# EAGLE design Shruthi-Analog-SVF-v03 (EAGLE 9.6.2)
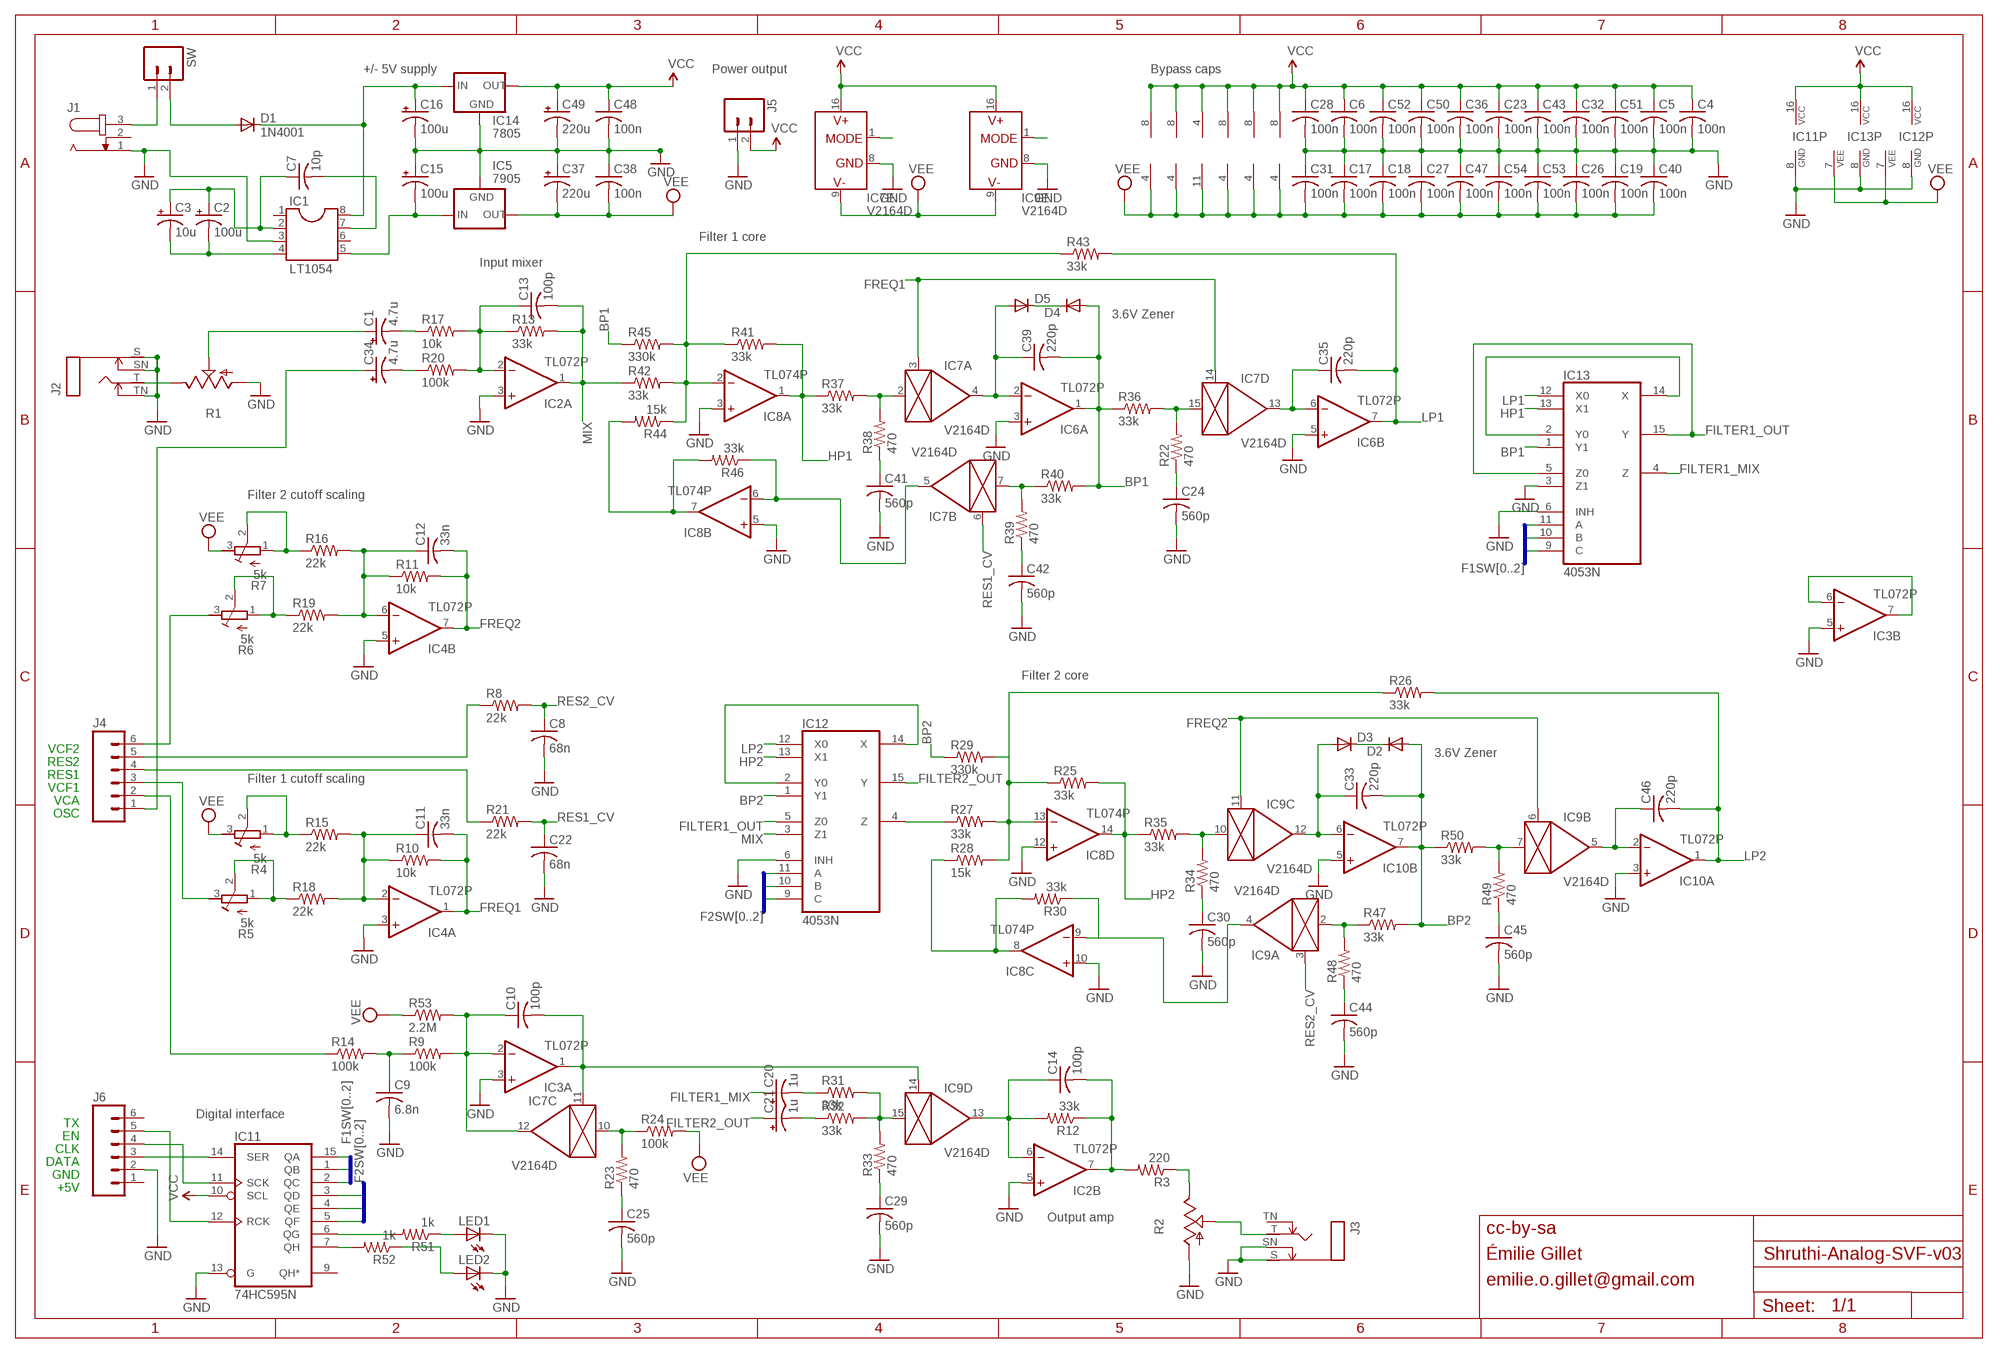
[diagram p0: schematic, sheet 1]

## Parts
C1  4.7u  CPOL-USE2.5-6  [E2,5-6]
C2  100u  CPOL-USE2.5-6  [E2,5-6]
C3  10u  CPOL-USE2.5-5  [E2,5-5]
C4  100n  C-US025-025X050  [C025-025X050]
C5  100n  C-US025-025X050  [C025-025X050]
C6  100n  C-US025-025X050  [C025-025X050]
C7  10p  C-US025-025X050  [C025-025X050]
C8  68n  C-US050-025X075  [C050-025X075]
C9  6.8n  C-US025-025X050  [C025-025X050]
C10  100p  C-US025-025X050  [C025-025X050]
C11  33n  C-US050-025X075  [C050-025X075]
C12  33n  C-US050-025X075  [C050-025X075]
C13  100p  C-US025-025X050  [C025-025X050]
C14  100p  C-US025-025X050  [C025-025X050]
C15  100u  CPOL-USE2.5-7  [E2,5-7]
C16  100u  CPOL-USE2.5-7  [E2,5-7]
C17  100n  C-US025-025X050  [C025-025X050]
C18  100n  C-US025-025X050  [C025-025X050]
C19  100n  C-US025-025X050  [C025-025X050]
C20  1u  CPOL-USE2-5  [E2-5]
C21  1u  CPOL-USE2-5  [E2-5]
C22  68n  C-US050-025X075  [C050-025X075]
C23  100n  C-US025-025X050  [C025-025X050]
C24  560p  C-US025-025X050  [C025-025X050]
C25  560p  C-US025-025X050  [C025-025X050]
C26  100n  C-US025-025X050  [C025-025X050]
C27  100n  C-US025-025X050  [C025-025X050]
C28  100n  C-US025-025X050  [C025-025X050]
C29  560p  C-US025-025X050  [C025-025X050]
C30  560p  C-US025-025X050  [C025-025X050]
C31  100n  C-US025-025X050  [C025-025X050]
C32  100n  C-US025-025X050  [C025-025X050]
C33  220p  C-US025-025X050  [C025-025X050]
C34  4.7u  CPOL-USE2.5-6  [E2,5-6]
C35  220p  C-US025-025X050  [C025-025X050]
C36  100n  C-US025-025X050  [C025-025X050]
C37  220u  CPOL-USE5-10.5  [E5-10,5]
C38  100n  C-US025-025X050  [C025-025X050]
C39  220p  C-US025-025X050  [C025-025X050]
C40  100n  C-US025-025X050  [C025-025X050]
C41  560p  C-US025-025X050  [C025-025X050]
C42  560p  C-US025-025X050  [C025-025X050]
C43  100n  C-US025-025X050  [C025-025X050]
C44  560p  C-US025-025X050  [C025-025X050]
C45  560p  C-US025-025X050  [C025-025X050]
C46  220p  C-US025-025X050  [C025-025X050]
C47  100n  C-US025-025X050  [C025-025X050]
C48  100n  C-US025-025X050  [C025-025X050]
C49  220u  CPOL-USE5-10.5  [E5-10,5]
C50  100n  C-US025-025X050  [C025-025X050]
C51  100n  C-US025-025X050  [C025-025X050]
C52  100n  C-US025-025X050  [C025-025X050]
C53  100n  C-US025-025X050  [C025-025X050]
C54  100n  C-US025-025X050  [C025-025X050]
D1  1N4001  1N4004  [DO41-10]
D2  DIODE-D-5  [D-5]
D3  DIODE-D-5  [D-5]
D4  DIODE-D-5  [D-5]
D5  DIODE-D-5  [D-5]
IC1  LT1054  DIL8  [DIL08]
IC2  TL072P  [DIL08]
IC3  TL072P  [DIL08]
IC4  TL072P  [DIL08]
IC5  7905  79XXS  [79XXS]
IC6  TL072P  [DIL08]
IC7  V2164D  SSM2164P  [DIL16]
IC8  TL074P  [DIL14]
IC9  V2164D  SSM2164P  [DIL16]
IC10  TL072P  [DIL08]
IC11  74HC595N  [DIL16]
IC12  4053N  [DIL16]
IC13  4053N  [DIL16]
IC14  7805  78XXS  [78XXS]
J1  JACK-PLUG2  [SPC4078_BIG_HOLES]
J2  MONOSWS  [NMJ4HC-S]
J3  MONOSWS  [NMJ4HC-S]
J4  M06SIP  [1X06]
J5  M02PTH  [1X02]
J6  M06SIP  [1X06]
LED1  LEDCHIP-LED0603  [CHIP-LED0603]
LED2  LEDCHIP-LED0603  [CHIP-LED0603]
R1  POT_USCABLED  [CABLE_POT_6MM]
R2  POT_USCABLED  [CABLE_POT_6MM]
R3  220  R-US_0204/7  [0204/7]
R4  5k  R-TRIMM3296X  [RTRIM3296X]
R5  5k  R-TRIMM3296X  [RTRIM3296X]
R6  5k  R-TRIMM3296X  [RTRIM3296X]
R7  5k  R-TRIMM3296X  [RTRIM3296X]
R8  22k  R-US_0204/7  [0204/7]
R9  100k  R-US_0204/7  [0204/7]
R10  10k  R-US_0204/7  [0204/7]
R11  10k  R-US_0204/7  [0204/7]
R12  33k  R-US_0204/7  [0204/7]
R13  33k  R-US_0204/7  [0204/7]
R14  100k  R-US_0204/7  [0204/7]
R15  22k  R-US_0204/7  [0204/7]
R16  22k  R-US_0204/7  [0204/7]
R17  10k  R-US_0204/7  [0204/7]
R18  22k  R-US_0204/7  [0204/7]
R19  22k  R-US_0204/7  [0204/7]
R20  100k  R-US_0204/7  [0204/7]
R21  22k  R-US_0204/7  [0204/7]
R22  470  R-US_0204/7  [0204/7]
R23  470  R-US_0204/7  [0204/7]
R24  100k  R-US_0204/7  [0204/7]
R25  33k  R-US_0204/7  [0204/7]
R26  33k  R-US_0204/7  [0204/7]
R27  33k  R-US_0204/7  [0204/7]
R28  15k  R-US_0204/7  [0204/7]
R29  330k  R-US_0204/7  [0204/7]
R30  33k  R-US_0204/7  [0204/7]
R31  33k  R-US_0204/7  [0204/7]
R32  33k  R-US_0204/7  [0204/7]
R33  470  R-US_0204/7  [0204/7]
R34  470  R-US_0204/7  [0204/7]
R35  33k  R-US_0204/7  [0204/7]
R36  33k  R-US_0204/7  [0204/7]
R37  33k  R-US_0204/7  [0204/7]
R38  470  R-US_0204/7  [0204/7]
R39  470  R-US_0204/7  [0204/7]
R40  33k  R-US_0204/7  [0204/7]
R41  33k  R-US_0204/7  [0204/7]
R42  33k  R-US_0204/7  [0204/7]
R43  33k  R-US_0204/7  [0204/7]
R44  15k  R-US_0204/7  [0204/7]
R45  330k  R-US_0204/7  [0204/7]
R46  33k  R-US_0204/7  [0204/7]
R47  33k  R-US_0204/7  [0204/7]
R48  470  R-US_0204/7  [0204/7]
R49  470  R-US_0204/7  [0204/7]
R50  33k  R-US_0204/7  [0204/7]
R51  1k  R-US_0204/7  [0204/7]
R52  1k  R-US_0204/7  [0204/7]
R53  2.2M  R-US_0204/2V  [0204V]
SW  M02PTH  [1X02]

## Nets
BP1: C39.2 D4.A IC6.1(A:OUT) IC13.1(Y1) R36.1 R40.2 R45.1
BP2: C33.2 D2.A IC10.7(B:OUT) IC12.1(Y1) R29.1 R47.2 R50.1
F1SW0: IC11.15(QA) IC13.9(C)
F1SW1: IC11.1(QB) IC13.10(B)
F1SW2: IC11.2(QC) IC13.11(A)
F2SW0: IC11.3(QD) IC12.9(C)
F2SW1: IC11.4(QE) IC12.10(B)
F2SW2: IC11.5(QF) IC12.11(A)
FILTER1_MIX: C20.+ IC13.4(Z)
FILTER1_OUT: IC12.5(Z0) IC13.5(Z0) IC13.15(Y)
FILTER2_OUT: C21.+ IC12.15(Y)
FREQ1: C11.2 IC4.1(A:OUT) IC7.3(A:CTRL) IC7.14(D:CTRL) R10.2
FREQ2: C12.2 IC4.7(B:OUT) IC9.6(B:CTRL) IC9.11(C:CTRL) R11.2
GND: C4.2 C5.2 C6.2 C8.2 C9.2 C15.+ C16.- C17.1 C18.1 C19.1 C22.2 C23.2 C24.2 C25.2 C26.1 C27.1 C28.2 C29.2 C30.2 C31.1 C32.2 C36.2 C37.+ C38.1 C40.1 C41.2 C42.2 C43.2 C44.2 C45.2 C47.1 C48.2 C49.- C50.2 C51.2 C52.2 C53.1 C54.1 IC1.3 IC2.3(A:+IN) IC2.5(B:+IN) IC3.3(A:+IN) IC3.5(B:+IN) IC4.3(A:+IN) IC4.5(B:+IN) IC5.GND IC6.3(A:+IN) IC6.5(B:+IN) IC7.8(E:GND) IC8.3(A:+IN) IC8.5(B:+IN) IC8.10(C:+IN) IC8.12(D:+IN) IC9.8(E:GND) IC10.3(A:+IN) IC10.5(B:+IN) IC11.8(GND) IC11.13(G) IC12.6(INH) IC12.8(GND) IC13.3(Z1) IC13.6(INH) IC13.8(GND) IC14.GND J1.1 J2.S J2.SN J2.TN J3.S J3.SN J5.1 J6.2 LED1.C LED2.C R1.A R2.A
HP1: IC8.1(A:OUT) IC13.13(X1) R37.1 R41.2
HP2: IC8.14(D:OUT) IC12.13(X1) R25.2 R35.1
LP1: C35.2 IC6.7(B:OUT) IC13.12(X0) R43.2
LP2: C46.2 IC10.1(A:OUT) IC12.12(X0) R26.2
MIX: C13.2 IC2.1(A:OUT) IC12.3(Z1) R13.2 R42.1
N$1: C2.+ C3.+ C7.1 IC1.2
N$2: C12.1 IC4.6(B:-IN) R11.1 R16.2 R19.2
N$3: J1.3 SW.1
N$4: C16.+ D1.C IC1.8 IC14.IN
N$5: C2.- C3.- IC1.4
N$6: C13.1 IC2.2(A:-IN) R13.1 R17.2 R20.2
N$7: R6.1(E) R6.2(S) R19.1
N$8: J4.6 R6.3(A)
N$9: R7.1(E) R7.2(S) R16.1
N$10: IC7.10(C:IN) R23.2 R24.1
N$11: C10.1 IC3.2(A:-IN) IC7.12(C:OUT) R9.2 R53.2
N$12: IC8.2(A:-IN) R41.1 R42.2 R43.1 R44.1 R45.2
N$13: IC11.12(RCK) J6.5
N$14: IC11.14(SER) J6.3
N$15: IC11.6(QG) R51.2
N$16: IC11.11(SCK) J6.4
N$17: C24.1 R22.1
N$18: IC8.13(D:-IN) R25.1 R26.1 R27.2 R28.2 R29.2
N$19: C39.1 D5.A IC6.2(A:-IN) IC7.4(A:OUT)
N$20: C33.1 D3.A IC9.12(C:OUT) IC10.6(B:-IN)
N$21: IC7.7(B:IN) R39.2 R40.1
N$22: C9.1 R9.1 R14.2
N$23: IC8.8(C:OUT) R28.1 R30.2
N$24: IC9.2(A:IN) R47.1 R48.2
N$25: R2.E R3.1
N$26: IC7.15(D:IN) R22.2 R36.2
N$27: C42.1 R39.1
N$28: C35.1 IC6.6(B:-IN) IC7.13(D:OUT)
N$29: IC7.2(A:IN) R37.2 R38.2
N$30: C41.1 R38.1
N$31: IC7.5(B:OUT) IC8.6(B:-IN) R46.1
N$32: LED1.A R51.1
N$33: D2.C D3.C
N$34: IC9.7(B:IN) R49.2 R50.2
N$35: C34.+ J4.1
N$36: C7.2 IC1.7
N$37: IC8.9(C:-IN) IC9.4(A:OUT) R30.1
N$38: J2.T R1.E
N$39: C34.- R20.1
N$40: C11.1 IC4.2(A:-IN) R10.1 R15.2 R18.2
N$41: R5.1(E) R5.2(S) R18.1
N$42: J4.3 R5.3(A)
N$43: R4.1(E) R4.2(S) R15.1
N$44: C46.1 IC9.5(B:OUT) IC10.2(A:-IN)
N$45: J4.2 R14.1
N$46: C45.1 R49.1
N$47: J3.T R2.S
N$48: IC8.7(B:OUT) R44.2 R46.2
N$49: C44.1 R48.1
N$50: IC9.10(C:IN) R34.2 R35.2
N$51: C30.1 R34.1
N$52: LED2.A R52.1
N$53: IC11.7(QH) R52.2
N$55: D4.C D5.C
N$56: C10.2 IC3.1(A:OUT) IC7.11(C:CTRL) IC9.14(D:CTRL)
N$57: C20.- R31.1
N$58: C15.- IC1.5 IC5.IN
N$59: D1.A SW.2
N$60: C21.- R32.1
N$61: IC3.6(B:-IN) IC3.7(B:OUT)
N$62: IC13.2(Y0) IC13.14(X)
N$63: C14.2 IC2.7(B:OUT) R3.2 R12.1
N$64: C25.1 R23.1
N$65: C29.1 R33.1
N$66: C1.+ R1.S
N$67: IC9.15(D:IN) R31.2 R32.2 R33.2
N$68: IC7.1(E:MODE)
N$69: J4.4 R21.1
N$70: C14.1 IC2.6(B:-IN) IC9.13(D:OUT) R12.2
N$71: IC9.1(E:MODE)
N$72: C1.- R17.1
N$73: J4.5 R8.1
N$74: IC12.2(Y0) IC12.14(X)
N$75: IC12.4(Z) R27.1
RES1_CV: C22.1 IC7.6(B:CTRL) R21.2
RES2_CV: C8.1 IC9.3(A:CTRL) R8.2
VCC: C4.1 C5.1 C6.1 C23.1 C28.1 C32.1 C36.1 C43.1 C48.1 C49.+ C50.1 C51.1 C52.1 IC2.8(P:V+) IC3.8(P:V+) IC4.8(P:V+) IC6.8(P:V+) IC7.16(E:V+) IC8.4(P:V+) IC9.16(E:V+) IC10.8(P:V+) IC11.10(SCL) IC11.16(VCC) IC12.16(VCC) IC13.16(VCC) IC14.OUT J5.2
VEE: C17.2 C18.2 C19.2 C26.2 C27.2 C31.2 C37.- C38.2 C40.2 C47.2 C53.2 C54.2 IC2.4(P:V-) IC3.4(P:V-) IC4.4(P:V-) IC5.OUT IC6.4(P:V-) IC7.9(E:V-) IC8.11(P:V-) IC9.9(E:V-) IC10.4(P:V-) IC12.7(VEE) IC13.7(VEE) R4.3(A) R7.3(A) R24.2 R53.1
Unconnected: IC1.1 IC1.6 IC11.9(QH*) J1.2 J3.TN J6.1 J6.6

## Buses
F1SW[0..2]
F2SW[0..2]

## Notes on the sheet
- +/- 5V supply | Power output | Bypass caps
- Filter 1 core
- Input mixer
- 3.6V Zener
- Filter 2 cutoff scaling
- Filter 2 core
- VCF2
- RES2 | 3.6V Zener
- RES1
- VCF1 | Filter 1 cutoff scaling
- VCA
- OSC
- TX | Digital interface
- EN
- CLK
- DATA
- GND
- +5V
- Output amp
- cc-by-sa
- Émilie Gillet
- emilie.o.gillet@gmail.com

## Library data of the parts
C1-C3 C15 C16 C20 C21 C34 C37 C49 = rcl:CPOL-US: POLARIZED CAPACITOR, American symbol
C4-C14 C17-C19 C22-C33 C35 C36 C38-C48 C50-C54 = rcl:C-US: CAPACITOR, American symbol
D1 = diode:1N4004: DIODE general purpose rectifier, 1 A
D2-D5 = diode:DIODE-: DIODE
IC1 = ic-package:DIL8: Dual In Line / Socket
IC2-IC4 IC6 IC10 = og-linear:TL072: OP AMP
IC5 = v-reg:79XXS: VOLTAGE REGULATOR
IC7 IC9 = ssm2164:SSM2164
IC8 = linear:TL074: OP AMP
IC11 = 74xx-eu:74*595: 8-bit SHIFT REGISTER, output latch
IC12 IC13 = 40xx:4053: Triple 2-channel ANALOG MULTIPLEXER
IC14 = v-reg:78XXS: VOLTAGE REGULATOR
J1 = con-jack2:JACK-PLUG: DC POWER JACK Power Jack, DC, Right Angle, Through Hole, Rated 5A at 16VDC, PC Terminals Distributor: Farnell (www.Farnell.de) Drawing: 84N1161.pdf / 84N1162.pdf Manufacturer: SPC Technology (www.spctechnology.com) Type: SPC4077 / SPC 4078
J2 J3 = gm-jacks:MONOSW
J4 J6 = SparkFun:M06: Header 6 Standard 6-pin 0.1" header. Use with straight break away headers (SKU : PRT-00116), right angle break away headers (PRT-00553), swiss pins (PRT-00743), machine pins (PRT-00117), and female headers (PRT-00115). Molex polarized connector foot print use with SKU : PRT-08094 with associated crimp pins and housings. NOTES ON THE VARIANTS LOCK and LOCK_LONGPADS... This footprint was designed to help hold the alignment of a through-hole component (i.e. 6-pin header) while soldering it into place. You may notice that each hole has been shifted either up or down by 0.005 of an inch from it's more standard position (which is a perfectly straight line). This slight alteration caused the pins (the squares in the middle) to touch the edges of the holes. Because they are alternating, it causes a "brace" to hold the component in place. 0.005 has proven to be the perfect amount of "off-center" position when using our standard breakaway headers. Although looks a little odd when you look at the bare footprint, once you have a header in there, the alteration is very hard to notice. Also, if you push a header all the way into place, it is covered up entirely on the bottom side. This idea of altering the position of holes to aid alignment will be further integrated into the Sparkfun Library for other footprints. It can help hold any component with 3 or more connection pins.
J5 SW = SparkFun:M02: Header 2 Standard 2-pin 0.1" header. Use with straight break away headers (SKU : PRT-00116), right angle break away headers (PRT-00553), swiss pins (PRT-00743), machine pins (PRT-00117), and female headers (PRT-00115). Molex polarized connector foot print use with SKU : PRT-08233 with associated crimp pins and housings.
LED1 LED2 = led:LED: LED OSRAM: - CHIPLED LG R971, LG N971, LY N971, LG Q971, LY Q971, LO R971, LY R971 LH N974, LH R974 LS Q976, LO Q976, LY Q976 LO Q996 - Hyper CHIPLED LW Q18S LB Q993, LB Q99A, LB R99A - SideLED LS A670, LO A670, LY A670, LG A670, LP A670 LB A673, LV A673, LT A673, LW A673 LH A674 LY A675 LS A676, LA A676, LO A676, LY A676, LW A676 LS A679, LY A679, LG A679 - Hyper Micro SIDELED® LS Y876, LA Y876, LO Y876, LY Y876 LT Y87S - SmartLED LW L88C, LW L88S LB L89C, LB L89S, LG L890 LS L89K, LO L89K, LY L89K LS L896, LA L896, LO L896, LY L896 - TOPLED LS T670, LO T670, LY T670, LG T670, LP T670 LSG T670, LSP T670, LSY T670, LOP T670, LYG T670 LG T671, LOG T671, LSG T671 LB T673, LV T673, LT T673, LW T673 LH T674 LS T676, LA T676, LO T676, LY T676, LB T676, LH T676, LSB T676, LW T676 LB T67C, LV T67C, LT T67C, LS T67K, LO T67K, LY T67K, LW E67C LS E67B, LA E67B, LO E67B, LY E67B, LB E67C, LV E67C, LT E67C LW T67C LS T679, LY T679, LG T679 LS T770, LO T770, LY T770, LG T770, LP T770 LB T773, LV T773, LT T773, LW T773 LH T774 LS E675, LA E675, LY E675, LS T675 LS T776, LA T776, LO T776, LY T776, LB T776 LHGB T686 LT T68C, LB T68C - Hyper Mini TOPLED® LB M676 - Mini TOPLED Santana® LG M470 LS M47K, LO M47K, LY M47K Source: http://www.osram.convergy.de LUXEON: - LUMILED® LXK2-PW12-R00, LXK2-PW12-S00, LXK2-PW14-U00, LXK2-PW14-V00 LXK2-PM12-R00, LXK2-PM12-S00, LXK2-PM14-U00 LXK2-PE12-Q00, LXK2-PE12-R00, LXK2-PE12-S00, LXK2-PE14-T00, LXK2-PE14-U00 LXK2-PB12-K00, LXK2-PB12-L00, LXK2-PB12-M00, LXK2-PB14-N00, LXK2-PB14-P00, LXK2-PB14-Q00 LXK2-PR12-L00, LXK2-PR12-M00, LXK2-PR14-Q00, LXK2-PR14-R00 LXK2-PD12-Q00, LXK2-PD12-R00, LXK2-PD12-S00 LXK2-PH12-R00, LXK2-PH12-S00 LXK2-PL12-P00, LXK2-PL12-Q00, LXK2-PL12-R00 Source: www.luxeon.com KINGBRIGHT: KA-3528ASYC Source: www.kingbright.com
R1 R2 = pot-alps:POT_US
R3 R8-R53 = rcl:R-US_: RESISTOR, American symbol
R4-R7 = rcl:R-TRIMM: Trimm resistor

## Board
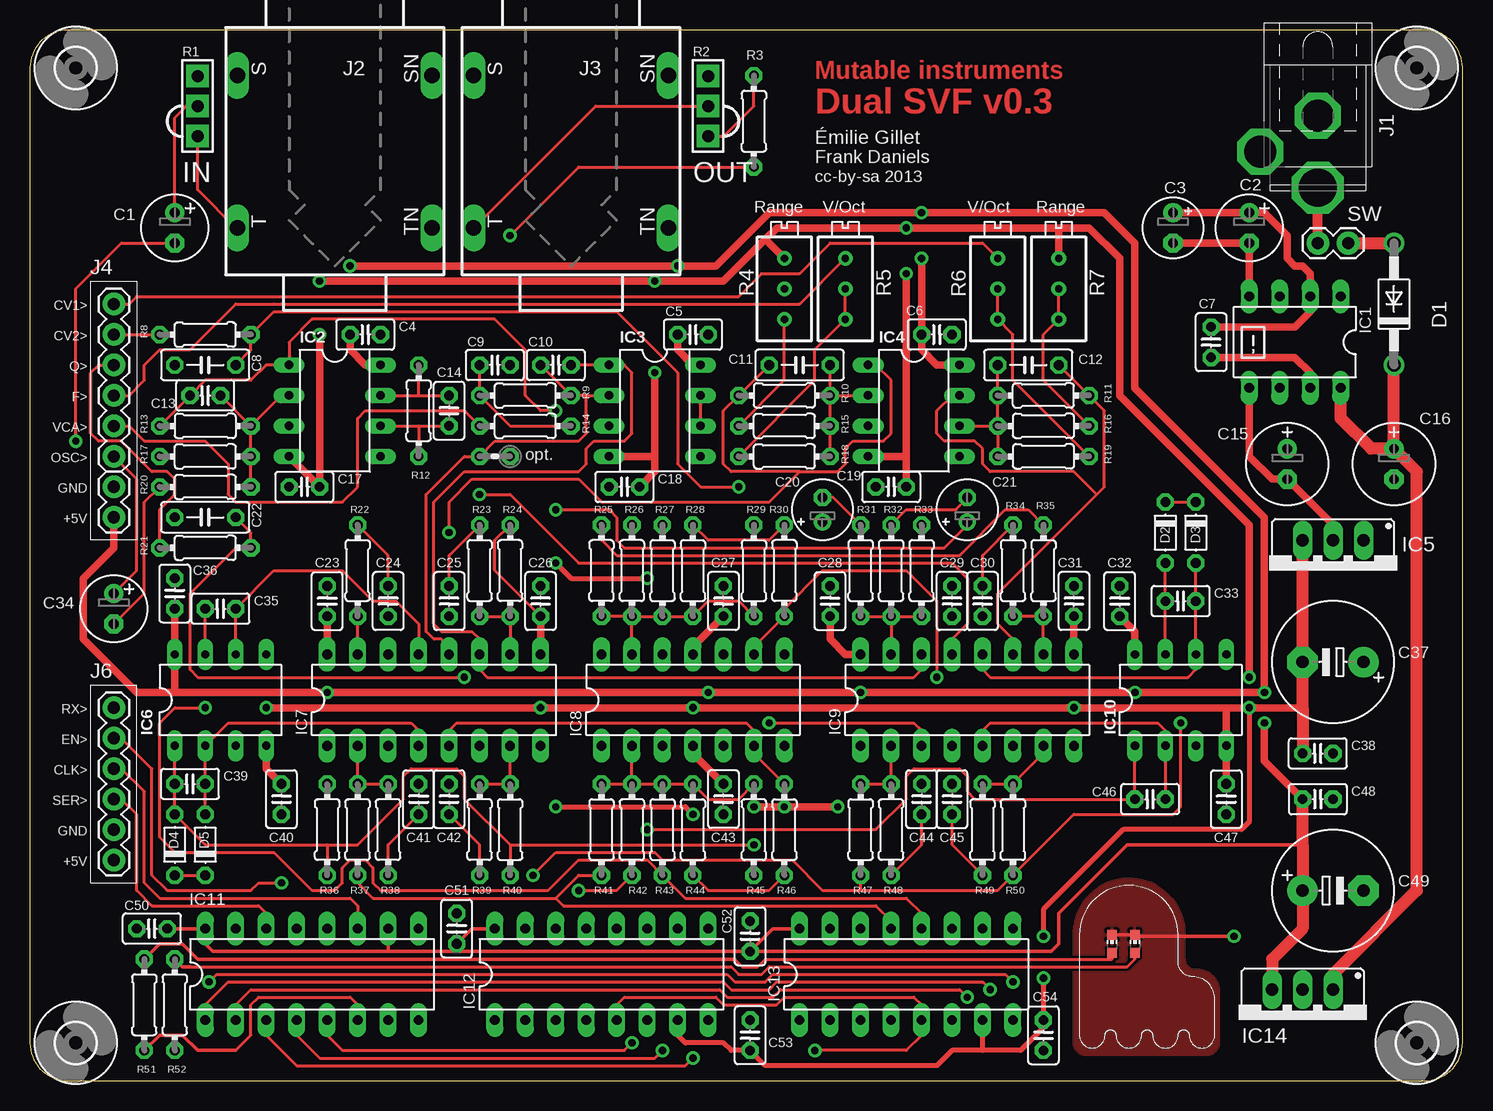
[diagram p1: board, top side]
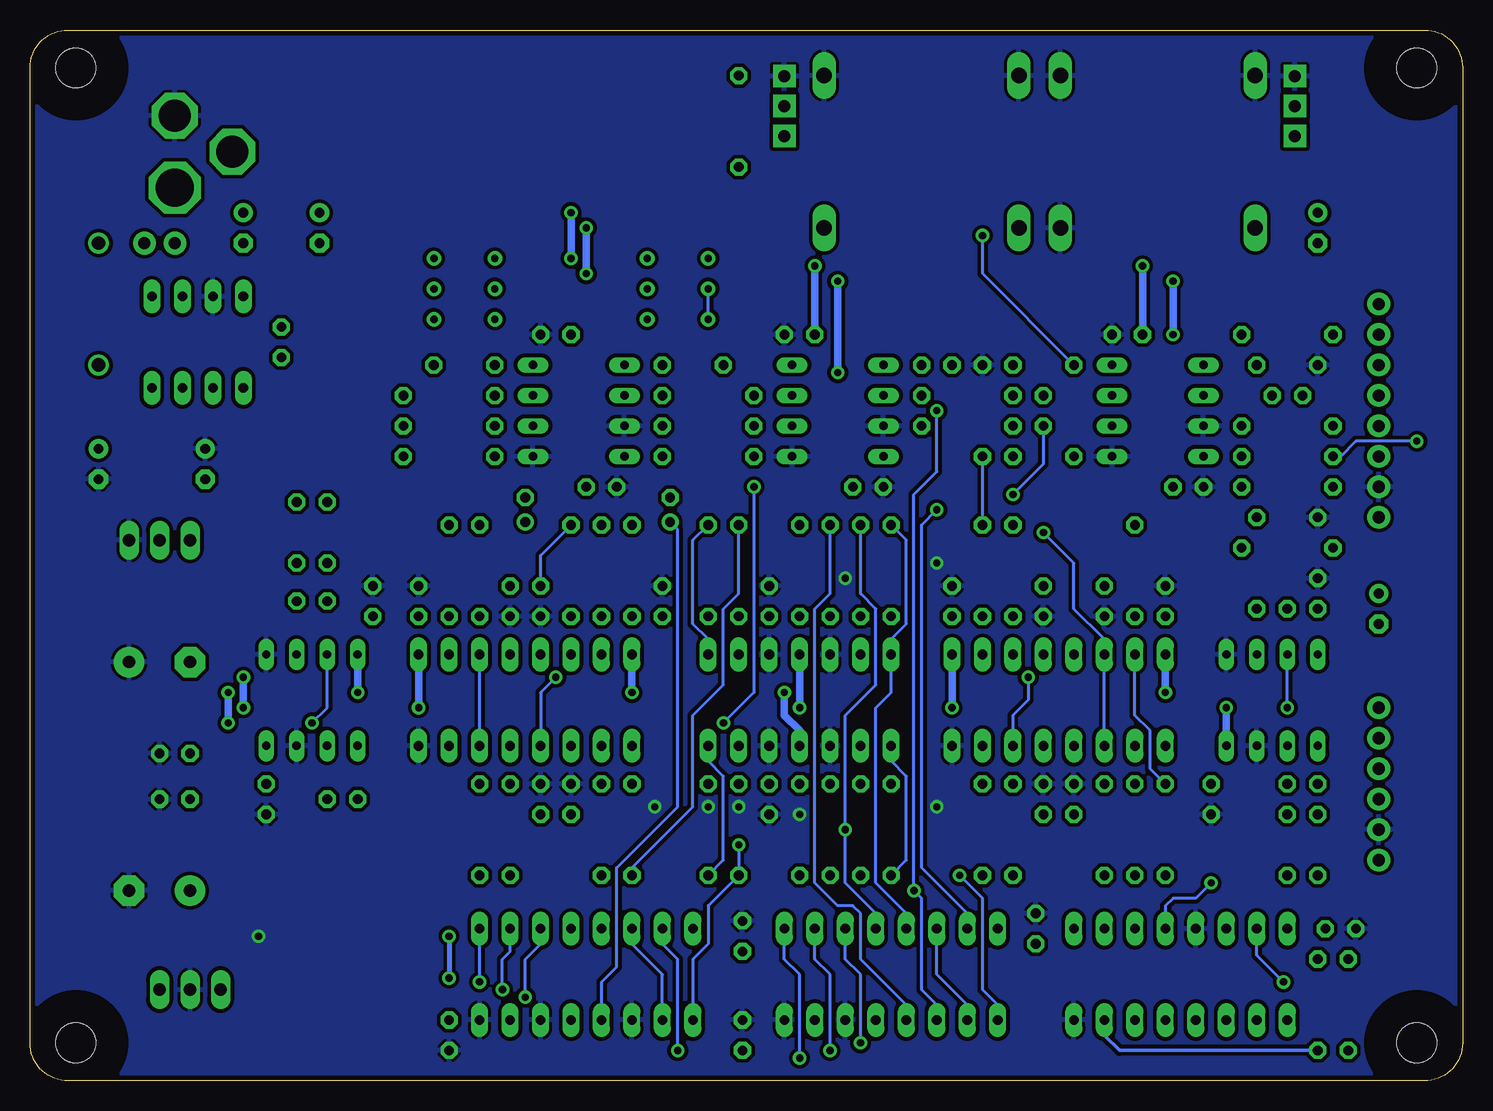
[diagram p2: board, bottom side, seen from below]

Size 119.38 x 87.62 mm. Coordinates in mm from the lower left corner, seen from the top.
Outline: 116.2,0 arc90 119.38,3.17 119.38,84.45 arc90 116.22,87.62 3.17,87.62 arc90 0,84.45 0,3.17 arc90 3.18,0 116.2,0
Copper layers (1*16): Top 0.035mm / dielectric 1.5mm / Bottom 0.035mm
Design rules "SparkFun *": minimum track width 8mil, minimum drill 20mil, track to track 8mil, track to pad 8mil, pad to pad 8mil, via to via 8mil, smd to smd 8mil, copper to edge 10mil, drill to drill 8mil, minimum pad ring 12mil, minimum via ring 10mil, stop-mask expansion 4mil, vias tented up to drill 25mil, thermal gap 10mil

### Footprints (pad centres in the part's own frame; a part is rotated, then mirrored left to right if it is on the bottom)
E2,5-6 = drill 0.813 pad 1.6: + -1.27,0 | drill 0.813 pad 1.6 octagon: - 1.27,0
E2,5-5 = drill 0.813 pad 1.6: + -1.27,0 | drill 0.813 pad 1.6 octagon: - 1.27,0
C025-025X050 = drill 0.813 octagon: 1 -1.27,0; 2 1.27,0
C050-025X075 = drill 0.813 octagon: 1 -2.54,0; 2 2.54,0
E2,5-7 = drill 0.813 pad 1.6: + -1.27,0 | drill 0.813 pad 1.6 octagon: - 1.27,0
E2-5 = drill 0.813 pad 1.27: + -1.016,0 | drill 0.813 pad 1.27 octagon: - 1.016,0
E5-10,5 = drill 1.016 pad 2.54: + -2.54,0 | drill 1.016 pad 2.54 octagon: - 2.54,0
DO41-10 = drill 1.118: A 5.08,0; C -5.08,0
D-5 = drill 0.813 octagon: A 2.54,0; C -2.54,0
DIL08 = drill 0.813 long: 1 -3.81,-3.81; 2 -1.27,-3.81; 3 1.27,-3.81; 4 3.81,-3.81; 5 3.81,3.81; 6 1.27,3.81; 7 -1.27,3.81; 8 -3.81,3.81
DIL08' = drill 0.7 long: 1 -3.81,-3.81; 2 -1.27,-3.81; 3 1.27,-3.81; 4 3.81,-3.81; 5 3.81,3.81; 6 1.27,3.81; 7 -1.27,3.81; 8 -3.81,3.81
79XXS = drill 1.016 long: GND -2.54,-2.54; IN 0,-2.54; OUT 2.54,-2.54
DIL16 = drill 0.813 long: 1 -8.89,-3.81; 2 -6.35,-3.81; 3 -3.81,-3.81; 4 -1.27,-3.81; 5 1.27,-3.81; 6 3.81,-3.81; 7 6.35,-3.81; 8 8.89,-3.81; 9 8.89,3.81; 10 6.35,3.81; 11 3.81,3.81; 12 1.27,3.81; 13 -1.27,3.81; 14 -3.81,3.81; 15 -6.35,3.81; 16 -8.89,3.81
DIL14 = drill 0.813 long: 1 -7.62,-3.81; 2 -5.08,-3.81; 3 -2.54,-3.81; 4 0,-3.81; 5 2.54,-3.81; 6 5.08,-3.81; 7 7.62,-3.81; 8 7.62,3.81; 9 5.08,3.81; 10 2.54,3.81; 11 0,3.81; 12 -2.54,3.81; 13 -5.08,3.81; 14 -7.62,3.81
78XXS = drill 1.016 long: GND 0,-2.54; IN -2.54,-2.54; OUT 2.54,-2.54
SPC4078_BIG_HOLES = drill 2.667 pad 3.81 octagon: 1 -0.46,0; 2 2.54,-4.8 | drill 3.175 pad 4.318 octagon: 3 5.54,0
NMJ4HC-S = drill 1.3 long: S 5.08,8.115; SN 5.08,-8.115; T -7.62,8.115; TN -7.62,-8.115
1X06 = drill 1.016 pad 1.88: 1 0,0; 2 2.54,0; 3 5.08,0; 4 7.62,0; 5 10.16,0; 6 12.7,0
1X02 = drill 1.016 pad 1.88: 1 0,0; 2 2.54,0
CHIP-LED0603 = smd 0.8 x 0.8: A 0,-0.75; C 0,0.75
CABLE_POT_6MM = drill 1 pad 1.88 square: A -2.5,0; E 2.5,0; S 0,0
0204/7 = drill 0.813 octagon: 1 -3.81,0; 2 3.81,0
RTRIM3296X = drill 0.61: 1 0,-2.54; 2 0,0; 3 0,2.54
0204V = drill 0.813 octagon: 1 -1.27,0; 2 1.27,0
3,3 = hole 3.3: 0,0

### Placement (x,y rotation side)
C1  12.07,71.12 270 top
C2  101.6,71.12 270 top
C3  95.25,71.12 270 top
C4  27.94,62.23 0 top
C5  55.24,62.23 0 top
C6  75.56,62.23 0 top
C7  98.42,61.59 270 top
C8  14.61,59.69 180 top
C9  38.73,59.69 0 top
C10  43.81,59.69 0 top
C11  64.14,59.69 180 top
C12  83.19,59.69 0 top
C13  14.61,57.15 180 top
C14  34.93,55.88 90 top
C15  104.78,51.44 270 top
C16  113.67,51.44 270 top
C17  22.86,49.53 0 top
C18  49.53,49.53 0 top
C19  71.75,49.53 0 top
C20  66.04,47.62 90 top
C21  78.11,47.62 90 top
C22  14.61,46.99 180 top
C23  24.77,40.01 90 top
C24  29.84,40.01 270 top
C25  34.93,40.01 270 top
C26  42.55,40.01 270 top
C27  57.78,40.01 270 top
C28  66.67,40.01 90 top
C29  76.83,40.01 270 top
C30  79.38,40.01 270 top
C31  87,40.01 270 top
C32  90.8,40.01 90 top
C33  95.89,40.01 180 top
C34  6.99,39.37 270 top
C35  15.88,39.37 180 top
C36  12.07,40.64 90 top
C37  108.58,34.92 180 top
C38  107.31,27.3 180 top
C39  13.34,24.76 180 top
C40  20.96,23.49 90 top
C41  32.38,23.49 90 top
C42  34.93,23.49 90 top
C43  57.78,23.49 270 top
C44  74.3,23.49 90 top
C45  76.83,23.49 90 top
C46  93.34,23.49 180 top
C47  99.69,23.49 90 top
C48  107.31,23.49 0 top
C49  108.58,15.88 0 top
C50  10.16,12.7 180 top
C51  35.56,12.7 90 top
C52  60.01,12.07 90 top
C53  60.01,3.81 270 top
C54  84.45,3.81 90 top
D1  113.67,64.77 90 top
D2  94.61,45.72 270 top
D3  97.16,45.72 270 top
D4  12.07,19.68 90 top
D5  14.61,19.68 90 top
IC1  105.41,61.59 180 top
IC2  TL072P  [DIL08']  25.4,55.88 270 top
IC3  TL072P  [DIL08']  52.07,55.88 270 top
IC4  TL072P  [DIL08']  73.66,55.88 270 top
IC5  108.58,42.55 180 top
IC6  TL072P  [DIL08']  15.88,31.75 0 top
IC7  33.66,31.75 0 top
IC8  55.24,31.75 0 top
IC9  78.11,31.75 0 top
IC10  TL072P  [DIL08']  95.89,31.75 0 top
IC11  23.5,8.89 0 top
IC12  47.62,8.89 0 top
IC13  73.03,8.89 0 top
IC14  106.05,5.08 180 top
J1  107.31,80.01 270 top
J2  25.4,78.74 90 top
J3  45.09,78.74 90 top
J4  6.99,52.07 90 top
J5  6.99,49.53 270 top
J6  6.99,18.41 90 top
LED1  90.17,11.43 0 top
LED2  92.08,11.43 0 top
R1  13.97,81.28 270 top
R2  56.52,81.28 270 top
R3  60.33,80.01 270 top
R4  62.87,66.04 0 top
R5  67.95,66.04 0 top
R6  80.64,66.04 0 top
R7  85.72,66.04 0 top
R8  14.61,62.23 0 top
R9  41.27,57.15 0 top
R10  62.87,57.15 180 top
R11  84.45,57.15 0 top
R12  32.38,55.88 270 top
R13  14.61,54.61 180 top
R14  41.27,54.61 0 top
R15  62.87,54.61 0 top
R16  84.45,54.61 180 top
R17  14.61,52.07 0 top
R18  62.87,52.07 0 top
R19  84.45,52.07 180 top
R20  14.61,49.53 0 top
R21  14.61,44.45 0 top
R22  27.3,42.55 270 top
R23  37.47,42.55 270 top
R24  40.01,42.55 90 top
R25  47.62,42.55 90 top
R26  50.16,42.55 90 top
R27  52.7,42.55 270 top
R28  55.24,42.55 270 top
R29  60.33,42.55 270 top
R30  62.87,42.55 90 top
R31  69.22,42.55 270 top
R32  71.75,42.55 270 top
R33  74.3,42.55 270 top
R34  81.92,42.55 270 top
R35  84.45,42.55 270 top
R36  24.77,20.95 90 top
R37  27.3,20.95 90 top
R38  29.84,20.95 90 top
R39  37.47,20.95 90 top
R40  40.01,20.95 270 top
R41  47.62,20.95 270 top
R42  50.16,20.95 90 top
R43  52.7,20.95 270 top
R44  55.24,20.95 270 top
R45  60.33,20.95 90 top
R46  62.87,20.95 270 top
R47  69.22,20.95 270 top
R48  71.75,20.95 90 top
R49  79.38,20.95 90 top
R50  81.92,20.95 90 top
R51  9.53,6.35 270 top
R52  12.07,6.35 270 top
R53  38.73,52.07 180 top
SW  107.31,69.85 0 top
U$1  [3,3]  3.81,84.45 0 top
U$2  [3,3]  115.57,84.45 0 top
U$3  [3,3]  3.81,3.17 0 top
U$4  [3,3]  115.57,3.17 0 top

### Tracks (layer width: path | path; a pad name or v marks a point on that pad's centre or on a via)
BP1  (via drill 0.6)
  Top 0.254: IC6.1 C39.2 D4.A 14.61,19.68 24.77,19.68 | 24.77,19.68 27.3,19.68 31.11,23.49 31.11,25.4 31.75,26.04 35.56,26.04 36.2,25.4 36.2,23.49 40.01,19.68 | 40.01,19.68 v60.33,19.68 | 40.01,19.68 R40.2 | 24.77,19.68 R36.1
  Bottom 0.254: IC13.1 64.14,10.16 62.87,11.43 62.87,14.61 R45.1 v60.33,19.68
BP2  (via drill 0.6)
  Top 0.254: IC10.7 C33.2 D2.A | 69.22,15.88 80.64,15.88 R50.1 87,22.22 95.25,22.22 95.89,22.86 v95.89,29.84 | 69.22,15.88 R47.2 | 69.22,15.88 66.04,15.88 63.5,18.41 52.7,18.41 52.07,19.05 43.81,19.05 v41.91,17.14
  Bottom 0.254: IC12.1 38.73,6.35 40.01,7.62 40.01,15.24 v41.91,17.14 | R29.1 60.33,40.64 61.59,39.37 61.59,33.02 64.14,30.48 64.14,22.86 69.22,17.78 R47.2 | v95.89,29.84 94.61,31.11 IC10.7
F1SW0  (via drill 0.6)
  Top 0.254: v14.92,8.26 15.56,8.89 58.1,8.89 58.74,8.26 61.28,8.26 61.91,8.89 80.64,8.89 81.28,8.89 v81.92,8.26
  Bottom 0.254: v81.92,8.26 IC13.9 | IC11.15 17.14,10.48 v14.92,8.26
F1SW1  (via drill 0.6)
  Top 0.254: IC11.1 14.61,6.35 16.51,8.26 57.78,8.26 58.42,7.62 61.59,7.62 62.23,8.26 79.38,8.26 v80.01,7.62
  Bottom 0.254: IC13.10 79.38,10.79 80.01,10.16 v80.01,7.62
F1SW2  (via drill 0.6)
  Top 0.254: IC11.2 17.14,6.35 18.41,7.62 57.47,7.62 58.1,6.98 61.91,6.98 62.55,7.62 77.47,7.62 v78.11,6.98
  Bottom 0.254: v78.11,6.98 78.11,10.16 76.83,11.43 IC13.11
F2SW0  (via drill 0.6)
  Top 0.254: IC11.3 19.68,3.81 22.23,1.27 54.61,1.27 v55.24,1.91
  Bottom 0.254: v55.24,1.91 55.24,8.89 56.52,10.16 IC12.9
F2SW1  (via drill 0.6)
  Top 0.254: IC11.4 22.23,3.81 24.13,1.91 52.07,1.91 v52.7,2.54
  Bottom 0.254: v52.7,2.54 52.7,8.89 53.98,10.16 IC12.10
F2SW2  (via drill 0.6)
  Top 0.254: IC11.5 24.77,3.81 26.04,2.54 49.53,2.54 v50.16,3.17
  Bottom 0.254: v50.16,3.17 50.16,8.89 51.44,10.16 IC12.11
FILTER1_MIX
  Bottom 0.254: IC13.4 71.75,8.26 70.48,9.53 70.48,17.78 65.41,22.86 65.41,45.97 C20.+
FILTER1_OUT  (via drill 0.6)
  Top 0.254: v65.41,2.54 73.03,2.54 74.3,3.81 IC13.5 74.3,6.35 73.66,6.98 62.87,6.98 62.23,6.35 57.78,6.35 57.15,6.98 49.53,6.98 48.89,6.35 IC12.5
  Bottom 0.254: IC13.15 66.67,11.43 65.41,10.16 v65.41,2.54
FILTER2_OUT  (via drill 0.6)
  Top 0.254: v43.81,47.62 48.26,47.62 48.89,46.99 48.89,45.09 49.53,44.45 76.2,44.45 78.11,46.36 C21.+
  Bottom 0.254: IC12.15 41.27,13.97 45.09,17.78 45.09,46.36 v43.81,47.62
FREQ1  (via drill 0.6)
  Top 0.254: v34.93,45.72 34.93,48.26 36.83,50.16 45.72,50.16 47.62,48.26 61.59,48.26 64.14,50.8 | IC4.1 70.48,59.69 71.75,58.42 71.75,53.98 71.12,53.34 68.58,53.34 67.95,52.71 67.95,51.44 67.31,50.8 64.14,50.8 | C11.2 R10.2 57.78,55.88 57.78,51.44 58.42,50.8 64.14,50.8
  Bottom 0.254: IC7.3 IC7.14 29.84,36.83 32.38,39.37 32.38,43.18 v34.93,45.72
FREQ2
  Top 0.254: C12.2 R11.2 89.53,55.88 89.53,49.53 88.9,48.9 | IC9.11 81.92,36.83 80.64,38.1 80.64,40.64 88.9,48.9 | IC4.7 76.83,57.15 75.56,55.88 75.56,53.98 76.2,53.34 78.74,53.34 79.38,52.71 79.38,51.44 80.01,50.8 87,50.8 88.9,48.9
  Bottom 0.254: IC9.6 IC9.11
GND  (via drill 0.6)
  Top 0.305: v100.33,12.07 92.19,12.07 LED2.C LED1.C
  Top 0.406: v43.81,22.86 54.61,22.86 v55.24,22.22 | v43.81,43.18 45.09,41.91 v51.44,41.91
  Top 0.61: v60.33,22.86 v62.87,22.86 v67.31,22.86
  pour Bottom (isolate 0.305): 0.64,87 0.64,0.64 118.75,0.64 118.75,87
  pour Top: 87,12.07 87,3.17 arc90 87.95,2.22 98.11,2.22 arc90 99.06,3.17 99.06,7.62 arc90 97.16,9.21 arc-90 96.2,10.16 96.2,12.38 arc90 91.44,16.83 arc90
HP1
  Top 0.254: 43.81,15.24 44.45,14.61 70.48,14.61 71.75,13.34 IC13.13 | 43.81,15.24 45.72,17.14 R41.2 | 43.81,15.24 28.57,15.24 27.3,16.51 R37.1
  Bottom 0.254: IC8.1 47.62,26.67 46.35,25.4 46.35,18.41 R41.2
HP2
  Top 0.254: R35.1 83.19,47.62 81.28,47.62 77.47,43.82 48.89,43.82 47.62,45.09 R25.2
  Bottom 0.254: IC12.13 46.35,13.97 48.89,16.51 48.89,31.11 47.62,32.38 IC8.14 47.62,36.83 46.35,38.1 46.35,45.09 R25.2
LP1  (via drill 0.6)
  Top 0.254: IC13.12 74.3,13.97 73.03,15.24 54.61,15.24 R43.2 51.44,18.41 45.72,18.41 43.18,15.88 29.21,15.88 28.57,16.51 28.57,17.78 27.94,18.41 26.67,18.41 26.04,17.78 26.04,16.51 25.4,15.88 23.5,15.88 20.32,19.05 12.07,19.05 10.79,20.32 10.79,29.84 12.07,31.11 v14.61,31.11 | IC6.7 C35.2
  Bottom 0.254: v14.61,31.11 IC6.7
LP2  (via drill 0.6)
  Top 0.254: IC10.1 C46.2 78.74,23.49 78.11,24.13 78.11,25.4 77.47,26.04 73.66,26.04 73.03,25.4 73.03,23.49 70.48,20.95 v51.44,20.95
  Bottom 0.254: IC12.12 48.89,13.97 51.44,16.51 v51.44,20.95 51.44,30.48 48.89,33.02 48.89,39.37 50.16,40.64 R26.2
MIX  (via drill 0.6)
  Top 0.254: R13.2 C13.2 14.61,58.42 18.41,58.42 19.68,59.69 IC2.1 21.59,61.59 23.5,63.5 38.73,63.5 41.27,60.96 41.27,57.15 42.55,55.88 v43.81,55.88 | R42.1 48.89,15.88 v45.72,15.88
  Bottom 0.254: IC12.3 43.81,6.35 45.09,7.62 45.09,15.24 v45.72,15.88 45.72,48.9 43.81,50.8 v43.81,55.88
N$1
  Top 0.61: C7.1 105.41,62.87 106.68,64.14 IC1.2 106.68,67.31 106.05,67.95 105.41,67.95 104.78,68.58 104.78,70.48 102.87,72.39 C2.+ C3.+
N$2
  Top 0.254: C12.1 R11.1 R16.2 | R16.2 R19.2 | IC4.6 R16.2
N$3
  Top 0.813: SW.1 J1.3
N$4
  Top 1.016: IC14.IN 108.58,8.89 115.57,15.88 115.57,50.8 C16.+ | C16.+ D1.C | IC1.8 109.22,55.25 111.76,52.71 C16.+
N$5
  Top 0.61: C3.- C2.- IC1.4
N$6
  Top 0.254: R13.1 C13.1 | R13.1 20.96,57.15 IC2.2 | R13.1 R17.2 R20.2
N$7
  Top 0.254: R19.1 81.92,58.42 81.92,62.23 R6.1 R6.2
N$8
  Top 0.254: J4.6 8.26,64.77 8.89,65.41 59.05,65.41 60.96,67.31 64.14,67.31 66.67,69.85 79.38,69.85 R6.3
N$9
  Top 0.254: R16.1 84.45,58.42 84.45,62.23 R7.1 R7.2
N$10
  Top 0.254: IC7.10 R24.1 R23.2
N$11
  Top 0.254: C10.1 R9.2 46.35,57.15 | 46.35,57.15 IC3.2 | IC7.12 34.93,36.2 34.29,36.83 33.66,36.83 33.02,37.47 33.02,48.9 36.2,52.07 R53.2 38.73,53.34 45.72,53.34 46.35,53.98 46.35,57.15
N$12
  Top 0.254: R42.2 R43.1 R44.1 56.52,23.49 59.05,23.49 R45.2 | R41.1 R42.2 | R42.2 IC8.2
N$13  (via drill 0.6)
  Top 0.254: J6.5 7.62,28.57 10.16,26.04 10.16,17.14 11.43,15.88 18.41,15.88 19.05,16.51 v20.96,16.51
  Bottom 0.254: v20.96,16.51 22.23,15.24 24.13,15.24 24.77,14.61 IC11.12
N$14
  Top 0.254: J6.3 7.62,23.49 8.89,22.22 8.89,15.88 10.16,14.61 19.05,14.61 19.68,13.97 IC11.14
N$15
  Top 0.254: 17.14,2.54 18.41,3.81 18.41,6.35 19.05,6.98 26.67,6.98 27.3,6.35 IC11.6
  Top 0.305: 17.14,2.54 13.97,2.54 12.7,3.81 10.79,3.81 R51.2
N$16
  Top 0.254: J6.4 7.62,26.04 9.53,24.13 9.53,16.51 10.79,15.24 26.67,15.24 27.3,14.61 IC11.11
N$17
  Top 0.254: C24.1 29.84,43.82 R22.1
N$18
  Top 0.254: R26.1 R25.1 | R26.1 R27.2 R28.2 56.52,40.01 59.05,40.01 R29.2 | IC8.13 R26.1
N$19
  Top 0.254: IC7.4 32.38,29.21 31.75,29.84 16.51,29.84 IC6.2 C39.1 D5.A
N$20
  Top 0.254: IC9.12 79.38,34.29 80.01,33.66 96.52,33.66 97.16,34.29 IC10.6 C33.1 D3.A
N$21
  Top 0.254: R39.2 R40.1 IC7.7
N$22
  Top 0.254: R14.2 40.01,54.61 R9.1 C9.1
N$23
  Top 0.254: R28.1 56.52,45.09 61.59,45.09 R30.2
  Bottom 0.254: IC8.8 62.87,36.83 64.14,38.1 64.14,45.09 R30.2
N$24
  Top 0.254: R47.1 R48.2 IC9.2
N$25
  Top 0.254: R3.1 60.33,81.28 57.83,78.78 R2.E
N$26
  Top 0.254: IC7.15 R22.2
  Bottom 0.254: IC7.15 27.3,30.48 26.04,29.21 26.04,26.04 R36.2
N$27
  Top 0.254: C42.1 37.47,19.68 R39.1
N$28
  Top 0.254: IC7.13 32.38,38.1 30.48,40.01 28.57,40.01 26.04,42.55 20.32,42.55 C35.1 IC6.6
N$29
  Top 0.254: R38.2 R37.2 IC7.2
N$30
  Top 0.254: C41.1 29.84,19.68 R38.1
N$31
  Top 0.254: R46.1 60.33,27.3 IC8.6 60.33,29.21 59.69,29.84 35.56,29.84 34.93,29.21 IC7.5
N$32
  Top 0.254: 58.74,10.16 59.37,9.53 60.64,9.53 61.28,10.16 90.17,10.16 LED1.A
  Top 0.305: 58.74,10.16 13.97,10.16 12.7,11.43 10.79,11.43 R51.1
N$33
  Top 0.254: D2.C D3.C
N$34
  Top 0.254: R49.2 R50.2 84.45,27.3 IC9.7
N$35
  Top 0.254: J4.1 8.89,50.16 8.89,42.55 C34.+
N$36
  Top 0.61: C7.2 105.41,60.33 106.68,59.05 IC1.7
N$37  (via drill 0.6)
  Top 0.254: IC8.9 60.33,36.2 R30.1 62.87,39.37 66.04,42.55 73.03,42.55 75.56,40.01 v75.56,33.66
  Bottom 0.254: 76.83,29.21 IC9.4 76.83,32.38 v75.56,33.66
N$38
  Top 0.254: J2.T 17.14,71.12 13.97,74.3 R1.E
N$39
  Top 0.254: C34.- 9.53,40.64 9.53,48.26 R20.1
N$40
  Top 0.254: R10.1 C11.1 | R10.1 R15.2 R18.2 | R10.1 IC4.2
N$41
  Top 0.254: R5.2 R5.1 65.41,60.96 65.41,58.42 R18.1
N$42
  Top 0.254: J4.3 8.26,57.15 9.53,58.42 9.53,59.69 10.79,60.96 13.34,60.96 17.14,64.77 20.32,64.77 20.96,64.77 64.14,64.77 R5.3
N$43
  Top 0.254: R15.1 62.87,58.42 R4.1
  Bottom 0.254: R4.1 R4.2
N$44
  Top 0.254: C46.1 IC10.2 94.61,29.21 93.98,29.84 80.01,29.84 79.38,29.21 IC9.5
N$45
  Top 0.254: J4.2 8.26,54.61 9.53,53.34 14.61,53.34 16.51,51.44 16.51,48.9 17.14,48.26 26.04,48.26 27.3,49.53 27.3,55.25 27.94,55.88 36.2,55.88 R14.1
N$46
  Top 0.254: R49.1 76.83,19.68 C45.1
N$47
  Top 0.254: J3.T 47.13,81.28 R2.S
N$48
  Top 0.254: R44.2 56.52,15.88 61.59,15.88 R46.2
  Bottom 0.254: IC8.7 62.87,26.67 61.59,25.4 61.59,18.41 R46.2
N$49
  Top 0.254: R48.1 74.3,19.68 C44.1
N$50
  Top 0.254: R34.2 R35.2 IC9.10
N$51
  Top 0.254: R34.1 79.38,43.82 C30.1
N$52
  Top 0.254: 13.34,9.53 58.42,9.53 59.05,8.89 60.96,8.89 61.59,9.53 91.44,9.53 92.08,10.16 LED2.A
  Top 0.305: 13.34,9.53 12.7,9.53 R52.1
N$53
  Bottom 0.305: IC11.7 29.84,4.45 29.84,3.81 28.57,2.54 R52.2
N$55
  Top 0.254: D4.C D5.C
N$56
  Top 0.254: C10.2 IC3.1 49.53,59.69 50.16,59.05 50.16,53.98 49.53,53.34 46.99,53.34 46.35,52.71 46.35,51.44 45.72,50.8 36.2,50.8 33.66,48.26 33.66,38.1 34.29,37.47 36.83,37.47 37.47,36.83 IC7.11 37.47,34.29 38.1,33.66 73.66,33.66 74.3,34.29 IC9.14
N$57
  Top 0.254: R31.1 66.93,48.64 C20.-
N$58
  Top 0.61: IC5.IN 108.58,46.36 C15.- 103.5,50.16 101.6,52.07 IC1.5
N$59
  Top 1.016: SW.2 D1.A
N$60
  Top 0.254: R32.1 73.03,47.62 77.15,47.62 78.11,48.58 C21.-
N$61
  Top 0.254: IC3.6 IC3.7
N$62
  Bottom 0.254: IC13.2 66.67,8.89 69.22,11.43 IC13.14
N$63  (via drill 0.6)
  Top 0.254: IC2.7 32.38,57.15 | 32.38,57.15 C14.2 | 32.38,57.15 R12.1 | R3.2 45.72,76.2 v40.01,70.48
  Bottom 0.254: R12.1 40.01,67.31 v40.01,70.48
N$64
  Top 0.254: C25.1 34.93,43.82 R23.1
N$65
  Bottom 0.254: R33.1 76.83,43.82 C29.1
N$66
  Top 0.254: C1.+ 12.07,80.33 13.02,81.28 R1.S
N$67
  Top 0.254: R31.2 R32.2 | R32.2 R33.2 | R32.2 IC9.15
N$69
  Top 0.254: J4.4 5.71,59.69 5.08,59.05 5.08,53.98 5.71,53.34 7.62,53.34 10.16,50.8 11.43,50.8 12.07,50.16 12.07,48.9 10.79,47.62 R21.1
N$70  (via drill 0.6)
  Top 0.254: IC9.13 76.83,36.83 78.11,38.1 78.11,41.91 76.83,43.18 45.72,43.18 40.01,48.9 v37.47,48.9 | IC2.6 32.38,54.61 | 32.38,54.61 C14.1 | 32.38,54.61 R12.2
  Bottom 0.254: v37.47,48.9 34.93,51.44 C14.1
N$72  (via drill 0.6)
  Top 0.254: C1.- 7.62,69.85 3.81,66.04 v3.81,53.34
  Bottom 0.254: v3.81,53.34 8.89,53.34 10.16,52.07 R17.1
N$73
  Top 0.254: J4.5 R8.1
N$74
  Bottom 0.254: IC12.2 41.27,6.35 43.81,8.89 IC12.14
N$75
  Bottom 0.254: IC12.4 46.35,6.35 50.16,10.16 50.16,13.97 50.8,14.61 52.07,14.61 53.98,16.51 53.98,39.37 52.7,40.64 R27.1
RES1_CV  (via drill 0.6)
  Top 0.254: C22.1 18.41,45.72 R21.2 17.14,44.45 13.34,40.64 13.34,34.29 13.97,33.66 v36.2,33.66
  Bottom 0.254: v36.2,33.66 36.2,31.75 37.47,30.48 IC7.6
RES2_CV  (via drill 0.6)
  Top 0.254: IC9.3 74.3,29.21 73.66,29.84 v61.59,29.84 | v59.05,49.53 55.88,49.53 53.98,51.44 53.98,59.05 48.89,64.14 20.32,64.14 R8.2 18.41,60.96 C8.1
  Bottom 0.254: v59.05,49.53 59.05,32.38 v61.59,29.84
VCC  (via drill 0.6)
  Top 0.305: C50.1 IC11.16 14.61,11.43 15.24,10.79 29.84,10.79 | 29.84,10.79 35.56,10.79 | 35.56,10.79 C51.1 36.83,12.7 IC12.16 | 35.56,10.79 C52.1 | 29.84,10.79 IC11.10 | C52.1 61.91,12.7 IC13.16 | C52.1 85.09,10.79 85.72,11.43 85.72,13.97 91.44,19.68 106.05,19.68
  Top 0.61: IC7.16 C23.1 | IC10.8 92.08,37.47 C32.1 | v26.67,67.95 v53.98,67.95 57.15,67.95 61.59,72.39 v74.3,72.39 89.53,72.39 92.08,69.85 92.08,57.79 102.87,46.99 v102.87,32.38 v92.08,32.38 v69.22,32.38 v56.52,32.38 v24.77,32.38 12.07,32.38 | C43.1 55.24,27.3 IC8.4 | 12.07,32.38 8.89,32.38 4.45,36.83 4.45,41.91 6.99,44.45 J5.2 | C48.1 102.87,26.67 v102.87,29.84 | IC2.8 27.94,59.69 26.67,60.96 C4.1 | IC3.8 55.24,59.69 53.98,60.96 C5.1 | C28.1 66.67,36.83 67.95,35.56 IC9.16 | v74.3,68.58 C6.1 74.3,60.96 75.56,59.69 IC4.8 | 12.07,32.38 IC6.8 C36.1
  Top 1.016: IC14.OUT 103.5,10.16 106.05,12.7 C49.+ 106.05,19.68 C48.1
  Bottom 0.61: v102.87,29.84 v102.87,32.38 | v24.77,32.38 IC7.16 | v69.22,32.38 IC9.16 | v92.08,32.38 IC10.8 | v26.67,67.95 C4.1 | v53.98,67.95 C5.1 | v74.3,72.39 v74.3,68.58 | v56.52,32.38 56.52,30.48 55.24,29.21 IC8.4
VEE  (via drill 0.6)
  Top 0.254: C26.2 38.73,42.55 38.73,45.09 R24.2
  Top 0.406: v101.6,31.11 101.6,21.59 100.97,20.95 91.12,20.95 84.45,14.29 v84.45,12.07 | IC12.7 53.98,3.81 54.61,3.17 57.78,3.17 58.42,2.54 C53.2 61.28,1.27 75.56,1.27 76.83,2.54 79.38,2.54 | 79.38,2.54 82.55,2.54 84.45,4.45 C54.2 v84.45,8.57 | 79.38,2.54 IC13.7
  Top 0.61: v19.68,31.11 v42.55,31.11 v55.24,31.11 v87,31.11 99.69,31.11 | 99.69,31.11 v101.6,31.11 106.05,31.11 | 99.69,31.11 IC10.4 C47.2 | v101.6,33.66 101.6,46.36 90.8,57.15 90.8,68.58 88.27,71.12 85.72,71.12 | v24.13,66.67 v52.07,66.67 57.78,66.67 61.28,70.17 | v52.07,59.05 52.07,52.07 | 52.07,52.07 52.07,50.8 C18.2 | v73.03,67.31 73.03,52.07 | 73.03,52.07 C19.2 | 73.03,52.07 IC4.4 | IC7.9 C26.2 | IC9.9 C31.2 | C27.2 55.24,36.2 IC8.11 | 85.72,71.12 v73.03,71.12 62.23,71.12 61.28,70.17 | v24.13,62.23 C17.2 IC2.4 | 52.07,52.07 IC3.4 | 85.72,71.12 R7.3 | 61.28,70.17 R4.3 | C40.2 19.68,26.04 IC6.4
  Top 1.016: C38.2 106.05,31.11 C37.- IC5.OUT
  Bottom 0.254: R24.2 R53.1
  Bottom 0.406: v84.45,12.07 v84.45,8.57
  Bottom 0.61: v42.55,31.11 IC7.9 | v87,31.11 IC9.9 | v101.6,31.11 v101.6,33.66 | v52.07,66.67 v52.07,59.05 | v73.03,71.12 v73.03,67.31 | v55.24,31.11 IC8.11 | v24.13,66.67 v24.13,62.23 | IC6.4 v19.68,31.11

### Text on the board
Top: Mutable instruments | Dual SVF v0.3
tPlace: CV1> | CV2> | Q> | F> | VCA> | OSC> | opt. | GND | +5V | RX> | EN> | CLK> | SER> | GND | +5V
tNames: Émilie Gillet | Frank Daniels | IN | OUT | cc-by-sa 2013 | Range | V/Oct | V/Oct | Range
tValues: 3.6V | 3.6V
tStop: Mutable instruments | Dual SVF v0.3